# EasyEDA Pro project AmpBoard64TP.eprj, schematic Mod8TP
Create Date: 2023-12-29; Page Name: P1; Project Name: Driver64TP; Schematic Name: Mod8TP; Update Date: 2023-12-29; Company: EasyEDA.com; Drawed: EasyEDA Pro; Page Size: A4; Part Number: JLCPCB-002; Reviewed: EasyEDA Pro; Version: V0.1
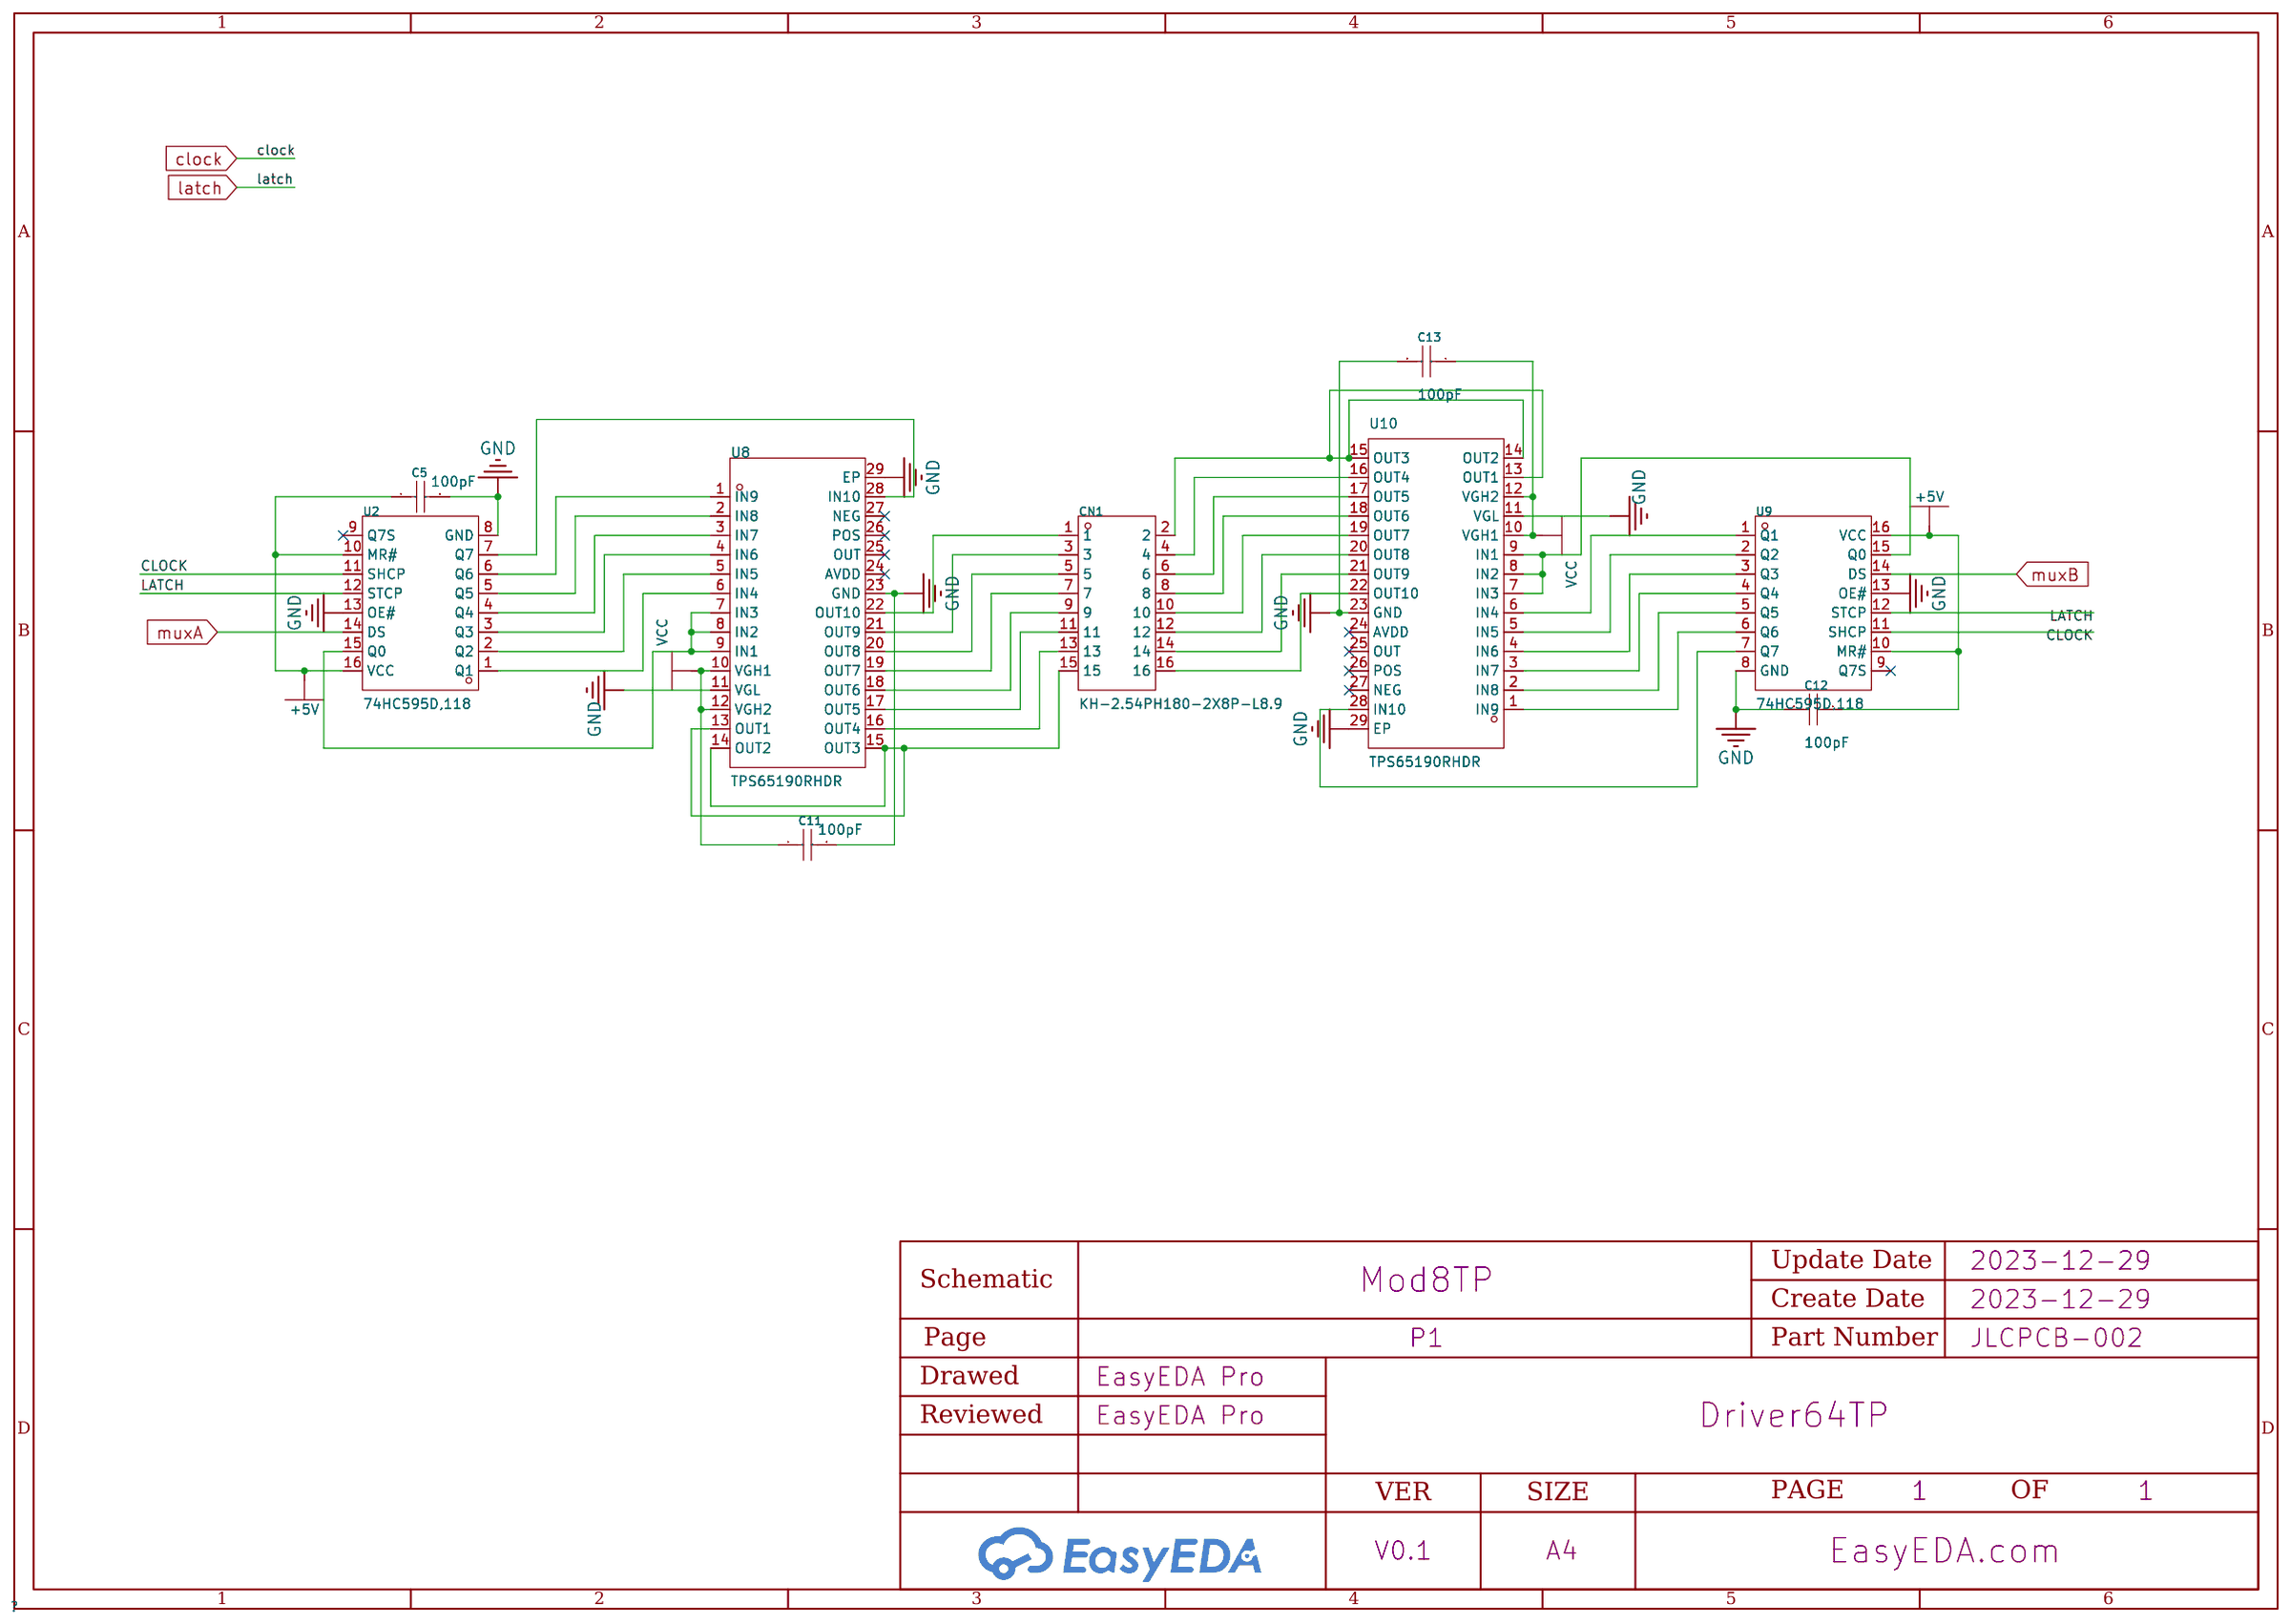
[diagram p1: schematic sheet]

## Parts
C5  100pF  [C0805]
C11  100pF  [C0805]
C12  100pF  [C0805]
C13  100pF  [C0805]
CN1  KH-2.54PH180-2X8P-L8.9  [CONN-TH_16P-P2.54_KINGHELM_KH-2.54PH180-2X8P-L8.9]
U2  74HC595D,118  [SOIC-16_L9.9-W3.9-P1.27-LS6.0-BL]
U8  TPS65190RHDR  [VQFN-28_L5.0-W5.0-P0.50-TL-EP3.2]
U9  74HC595D,118  [SOIC-16_L9.9-W3.9-P1.27-LS6.0-BL]
U10  TPS65190RHDR  [VQFN-28_L5.0-W5.0-P0.50-TL-EP3.2]

## Library data of the parts
C5 C11-C13 = CL21C101JBANNNC: Capacitance: Tolerance:±5% Tolerance:±5% Voltage Rated: Temperature Coefficient:; LCSC Part Name: 100pF ±5% 50V; Supplier Part: C1790; Manufacturer: SAMSUNG(三星); Supplier Footprint: 0805; JLCPCB Part Class: Basic Part; Datasheet: https://atta.szlcsc.com/upload/public/pdf/source/20160218/1457707763339.pdf; Supplier: LCSC; Tolerance: ±5%
CN1 = KH-2.54PH180-2X8P-L8.9: Connector Type:简牛座 Pitch:2.54mm Structure:2x8P Holder Type:Straight Number of Rows:2 Pin Number in each Row:8; LCSC Part Name: 2.54mm 2x8P 排数:2 每排P数:8; Supplier Part: C5157631; Manufacturer: kinghelm(金航标); Supplier Footprint: 插件,P=2.54mm; JLCPCB Part Class: Extended Part; Datasheet: https://atta.szlcsc.com/upload/public/pdf/source/20220902/BDDF6E62C6922AC108506376901906B3.pdf; Supplier: LCSC; Connector Type: 简牛座; Pitch: 2.54mm; Structure: 2x8P; Holder Type: Straight; Number of Rows: 2; Pin Number in each Row: 8
U2 U9 = 74HC595D,118: Series: Number of Bits per Element:8 Output Type:Tri-State Function:串行至并行或串行 Supply Voltage:2V~6V Supply Voltage:2V~6V Operating Temperature:40℃~+125℃ Operating Temperature:40℃~+125℃; LCSC Part Name: 三态输出 串行至串行或并行移位寄存器; Supplier Part: C5947; Manufacturer: Nexperia(安世); Supplier Footprint: SOP-16; JLCPCB Part Class: Basic Part; Datasheet: https://atta.szlcsc.com/upload/public/pdf/source/20140108/1457706668762.pdf; Supplier: LCSC; Number of Bits per Element: 8; Output Type: Tri-State; Function: 串行至并行或串行; Supply Voltage: 2V~6V; Operating Temperature: 40℃~+125℃
U8 U10 = TPS65190RHDR: Supplier Part: C2652779; Manufacturer: TI(德州仪器); Supplier Footprint: VQFN-28-EP(5x5); JLCPCB Part Class: Extended Part; Datasheet: https://atta.szlcsc.com/upload/public/pdf/source/20230228/2B5B66CA8C93676EA697F11780063A6D.pdf; Supplier: LCSC

## Nets
+5V: C5.1 C12.1 U2.10(MR#) U2.16(VCC) U9.10(MR#) U9.16(VCC)
GND: C5.2 C11.2 C12.2 C13.2 U2.8(GND) U2.13(OE#) U8.11(VGL) U8.23(GND) U8.29(EP) U9.8(GND) U9.13(OE#) U10.11(VGL) U10.23(GND) U10.29(EP)
VCC: C11.1 C13.1 U8.10(VGH1) U8.12(VGH2) U10.10(VGH1) U10.12(VGH2)
CLOCK: U2.11(SHCP) U9.11(SHCP)
LATCH: U2.12(STCP) U9.12(STCP)
muxA: U2.14(DS)
muxB: U9.14(DS)
$1N787: CN1.13 U8.16(OUT4)
$1N791: CN1.11 U8.17(OUT5)
$1N795: CN1.9 U8.18(OUT6)
$1N799: CN1.7 U8.19(OUT7)
$1N803: CN1.5 U8.20(OUT8)
$1N807: CN1.3 U8.21(OUT9)
$1N811: CN1.1 U8.22(OUT10)
$1N815: CN1.15 U8.13(OUT1) U8.14(OUT2) U8.15(OUT3)
$1N826: U2.15(Q0) U8.7(IN3) U8.8(IN2) U8.9(IN1)
$1N837: U2.1(Q1) U8.6(IN4)
$1N841: U2.2(Q2) U8.5(IN5)
$1N845: U2.3(Q3) U8.4(IN6)
$1N849: U2.4(Q4) U8.3(IN7)
$1N853: U2.5(Q5) U8.2(IN8)
$1N857: U2.6(Q6) U8.1(IN9)
$1N861: U2.7(Q7) U8.28(IN10)
$1N888: CN1.4 U10.16(OUT4)
$1N892: CN1.6 U10.17(OUT5)
$1N896: CN1.8 U10.18(OUT6)
$1N900: CN1.10 U10.19(OUT7)
$1N904: CN1.12 U10.20(OUT8)
$1N908: CN1.14 U10.21(OUT9)
$1N912: CN1.16 U10.22(OUT10)
$1N916: CN1.2 U10.13(OUT1) U10.14(OUT2) U10.15(OUT3)
$1N927: U9.15(Q0) U10.7(IN3) U10.8(IN2) U10.9(IN1)
$1N938: U9.1(Q1) U10.6(IN4)
$1N942: U9.2(Q2) U10.5(IN5)
$1N946: U9.3(Q3) U10.4(IN6)
$1N950: U9.4(Q4) U10.3(IN7)
$1N954: U9.5(Q5) U10.2(IN8)
$1N958: U9.6(Q6) U10.1(IN9)
$1N962: U9.7(Q7) U10.28(IN10)

Not connected (* = marked no-connect by the designer): U2 9(Q7S)*; U8 24(AVDD)* 25(OUT)* 26(POS)* 27(NEG)*; U9 9(Q7S)*; U10 24(AVDD)* 25(OUT)* 26(POS)* 27(NEG)*
